# Altium schematic sheet Battery Management Module.SchDoc
size A4; SheetNumber: 1; SheetTotal: 2
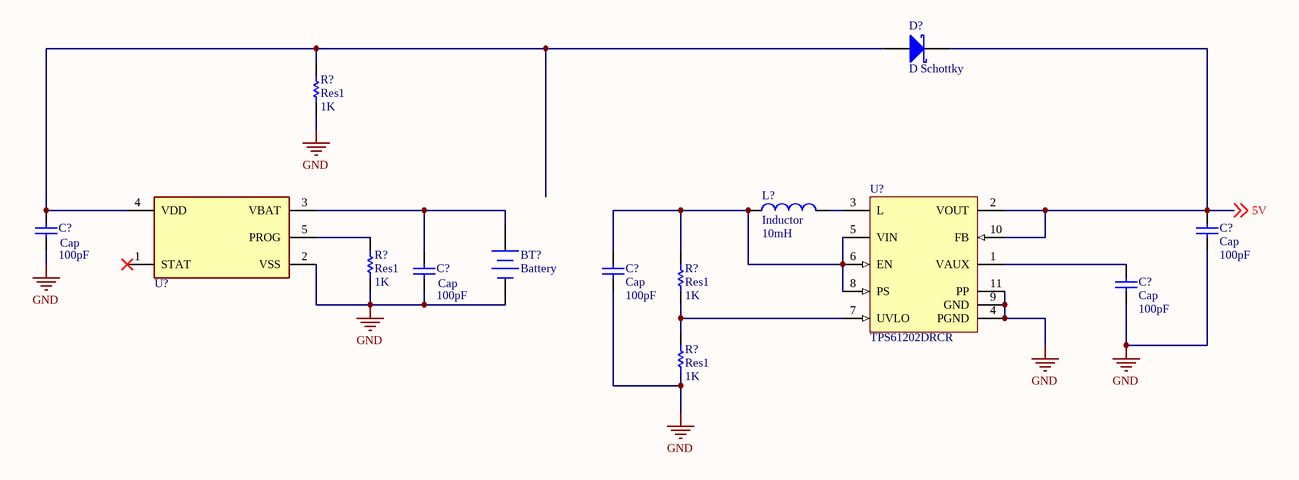
[diagram p0: Battery Management Module.SchDoc]

## Parts
(Parts that share a designator on the sheet are numbered #1, #2 ... from top to bottom, then left to right.)
BT?  Battery  [BAT-2]
C?#1  Cap  value 100pF  [RAD-0.3]
C?#2  Cap  value 100pF  [RAD-0.3]
C?#3  Cap  value 100pF  [RAD-0.3]
C?#4  Cap  value 100pF  [RAD-0.3]
C?#5  Cap  value 100pF  [RAD-0.3]
D?  D Schottky  [SMB]
L?  Inductor  value 10mH  [0402-A]
R?#1  Res1  value 1K  [AXIAL-0.3]
R?#2  Res1  value 1K  [AXIAL-0.3]
R?#3  Res1  value 1K  [AXIAL-0.3]
R?#4  Res1  value 1K  [AXIAL-0.3]
U?#1  TPS61202DRCR  [DRC10-2400X1650TP]
U?#2  MCP73831T-2ATI-OT  (value not drawn)

## Nets
GND: BT?.2(-) C?#1.2 C?#2.1 C?#3.1 C?#4.1 C?#5.2 R?#1.1 R?#2.1 R?#4.1 U?#1.4(PGND) U?#1.9(GND) U?#1.11(PP) U?#2.2(VSS)
5V: C?#1.1 D?.2(K) U?#1.2(VOUT) U?#1.10(FB) ; off-sheet 5V
NetBT?_1: BT?.1(+) C?#3.2 U?#2.3(VBAT)
NetC?#2_2: C?#2.2 D?.1(A) R?#1.2 U?#2.4(VDD)
NetC?#4_2: C?#4.2 L?.1 R?#3.2 U?#1.5(VIN) U?#1.6(EN) U?#1.8(PS)
NetC?#5_1: C?#5.1 U?#1.1(VAUX)
NetL?_2: L?.2 U?#1.3(L)
NetR?#2_2: R?#2.2 U?#2.5(PROG)
NetR?#3_1: R?#3.1 R?#4.2 U?#1.7(UVLO)

Not connected (* = marked no-connect by the designer): U?#2 1(STAT)*

## Library data of the parts
BT? = Battery: Multicell Battery; Published: 24-Mar-1999; LatestRevisionDate: 17-Jul-2002; LatestRevisionNote: Re-released for DXP Platform.; PackageReference: BAT-2; Publisher: Altium Limited; PackageDescription: Battery; 2 Leads
C?#1-C?#5 = Cap: Capacitor; Published: 8-Jun-2000; LatestRevisionDate: 17-Jul-2002; LatestRevisionNote: Re-released for DXP Platform.; PackageReference: RAD-0.3; Publisher: Altium Limited; PackageDescription: Radial Cap, Thru-Hole; 2 Leads; 0.3 in Pin Spacing
D? = D Schottky: Schottky Diode; Published: 8-Jun-2000; LatestRevisionDate: 17-Jul-2002; LatestRevisionNote: Re-released for DXP Platform.; PackageReference: SMB; Publisher: Altium Limited; PackageDescription: DO-214-AA/SMB; 2 C-Bend Leads; Body 5.3 x 3.6 mm, inc. leads (LxW); Code_JEDEC: DO-214-AA
L? = Inductor: Code_IEC: 1005; Published: 8-Jun-2000; LatestRevisionDate: 29-May-2009; LatestRevisionNote: IPC-7351 Footprint Added.; PackageReference: 0402-A; Publisher: Altium Limited; PackageDescription: Chip Inductor; Code_JEITA: 0402
R?#1-R?#4 = Res1: Resistor; Published: 8-Jun-2000; LatestRevisionDate: 17-Jul-2002; LatestRevisionNote: Re-released for DXP Platform.; PackageReference: AXIAL-0.3; Publisher: Altium Limited; PackageDescription: Axial Device, Thru-Hole; 2 Leads; 0.3 in Pin Spacing
U?#1 = TPS61202DRCR: Boost Voltage Converter with 0.3 to 5.5 V Input and 5 V Output, -40 to 85 degC, 10-Pin SON (DRC), Green (RoHS & no Sb/Br); Manufacturer: Texas Instruments; Vout(Min)(V): 5; Vin(Min)(V): 0.3; SubFamily: Step-Up Regulator; Vin(Max)(V): 5.5; Switching Frequency(Max)(kHz): 1250; Synchronous Rectification: TRUE; Regulated Outputs(#): 1; PackageReference: DRC10-2400X1650TP; Preset Vout(V): 5; Eco-Plan: Green (RoHS & no Sb/Br); PartNumber: TPS61202DRCR; ComponentLink1Description: Datasheet; ComponentLink2Description: Package Specification; DatasheetVersion: SLVS577B; ComponentLink1URL: http://www.ti.com/general/docs/lit/getliterature.tsp?genericPartNumber=TPS61202&fileType=pdf; ComponentLink2URL: http://www.ti.com/litv/pdf/mpds117k; Topology: Boost; PackageVersion: revL, Sep-2011; Vout(Max)(V): 5; Mounting Technology: Surface Mount; PackageDescription: 10-Pin Plastic Small Outline No-Lead, 3 x 3 x 1 mm Body, 0.5 mm Pitch, Exposed Pad